# EAGLE design Mono main board V3 (EAGLE 7.4.0)

## Sheet 1 of 4
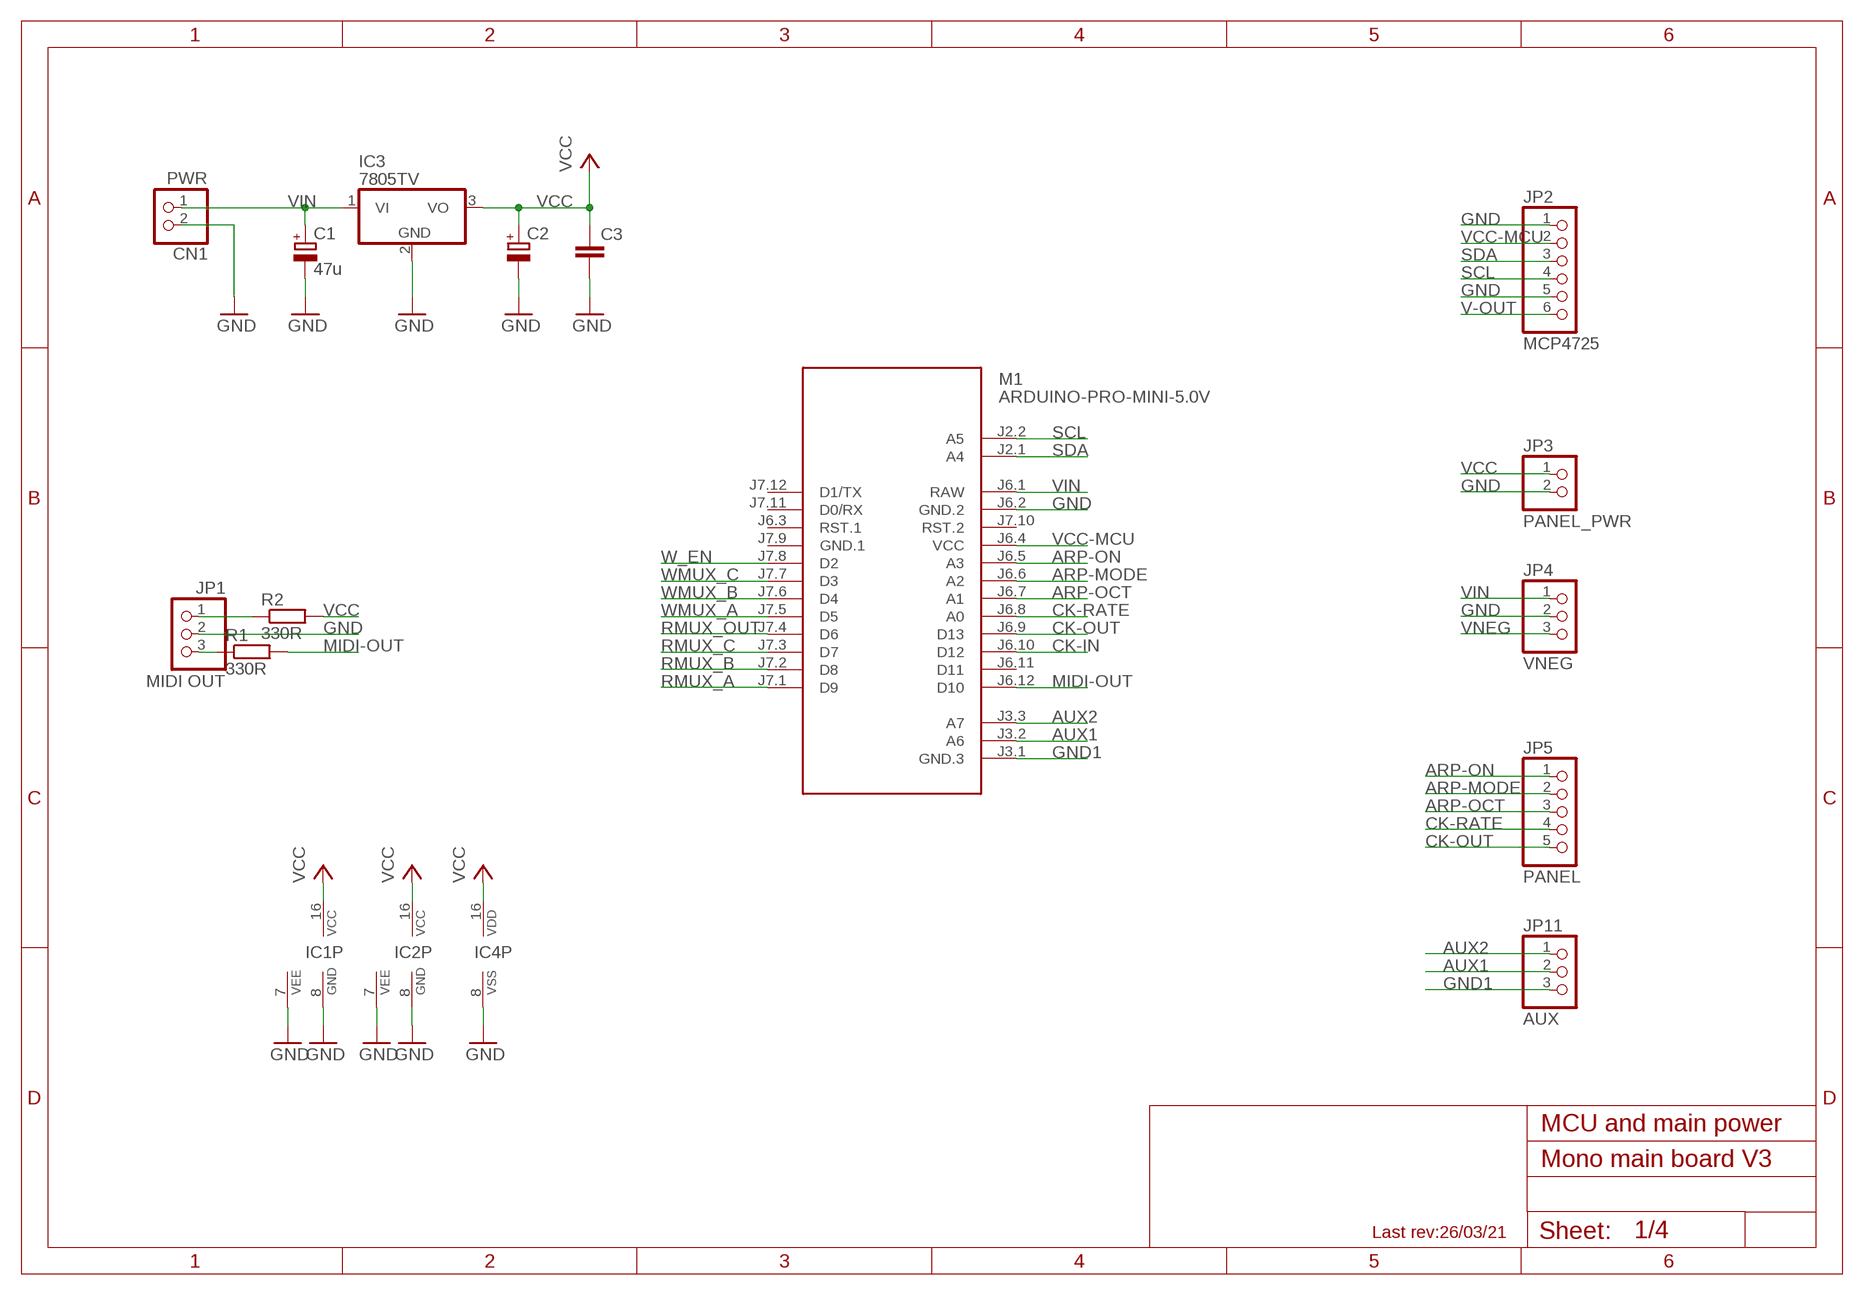
[diagram p0: schematic, sheet 1]

### Parts
C1  47u  CPOL-EUE5-8.5  [E5-8,5]
C2  CPOL-EUE5-8.5  [E5-8,5]
C3  C-EU050-025X075  [C050-025X075]
CN1  PWR  JST_2PIN-THM  [JST-PH-2-THM]
IC1  4051D  [SO16]
IC2  4051D  [SO16]
IC3  7805TV  [TO220V]
IC4  4040N  [DIL16]
JP1  MIDI OUT  PINHD-1X3  [1X03]
JP2  MCP4725  PINHD-1X6CB  [1X06-CLEANBIG]
JP3  PANEL_PWR  PINHD-1X2  [1X02]
JP4  VNEG  PINHD-1X3  [1X03]
JP5  PANEL  PINHD-1X5  [1X05]
JP11  AUX  PINHD-1X3  [1X03]
M1  ARDUINO-PRO-MINI-5.0V  ARDUINO-PRO-MINI-5.0V#NP  [ARDUINO-PRO-MINI#NP]
R1  330R  R-EU_R0805  [R0805]
R2  330R  R-EU_R0805  [R0805]

### Nets
ARP-MODE: JP5.2 M1.J6.6(A2)
ARP-OCT: JP5.3 M1.J6.7(A1)
ARP-ON: JP5.1 M1.J6.5(A3)
AUX1: JP11.2 M1.J3.2(A6)
AUX2: JP11.1 M1.J3.3(A7)
CK-IN: M1.J6.10(D12) ; also sheet 2
CK-OUT: JP5.5 M1.J6.9(D13)
CK-RATE: JP5.4 M1.J6.8(A0)
GND: C1.- C2.- C3.2 CN1.2 IC1.7(VEE) IC1.8(GND) IC2.7(VEE) IC2.8(GND) IC3.2(GND) IC4.8(VSS) JP1.2 JP2.1 JP2.5 JP3.2 JP4.2 M1.J6.2(GND.2) ; also sheet 2,3,4
GND1: JP11.3 M1.J3.1(GND.3)
MIDI-OUT: M1.J6.12(D10) R1.2
N$5: JP1.1 R2.1
N$6: JP1.3 R1.1
RMUX_A: M1.J7.1(D9) ; also sheet 2
RMUX_B: M1.J7.2(D8) ; also sheet 2
RMUX_C: M1.J7.3(D7) ; also sheet 2
RMUX_OUT: M1.J7.4(D6) ; also sheet 2
SCL: JP2.4 M1.J2.2(A5)
SDA: JP2.3 M1.J2.1(A4)
V-OUT: JP2.6 ; also sheet 3
VCC: C2.+ C3.1 IC1.16(VCC) IC2.16(VCC) IC3.3(VO) IC4.16(VDD) JP3.1 R2.2 ; also sheet 2,3
VCC-MCU: JP2.2 M1.J6.4(VCC)
VIN: C1.+ CN1.1 IC3.1(VI) JP4.1 M1.J6.1(RAW) ; also sheet 4
VNEG: JP4.3 ; also sheet 3,4
W_EN: M1.J7.8(D2) ; also sheet 2
WMUX_A: M1.J7.5(D5) ; also sheet 2
WMUX_B: M1.J7.6(D4) ; also sheet 2
WMUX_C: M1.J7.7(D3) ; also sheet 2
Unconnected: M1.J6.3(RST.1) M1.J6.11(D11) M1.J7.10(RST.2) M1.J7.11(D0/RX) M1.J7.12(D1/TX)

### Notes on the sheet
- MCU and main power
- Last rev:26/03/21

## Sheet 2 of 4
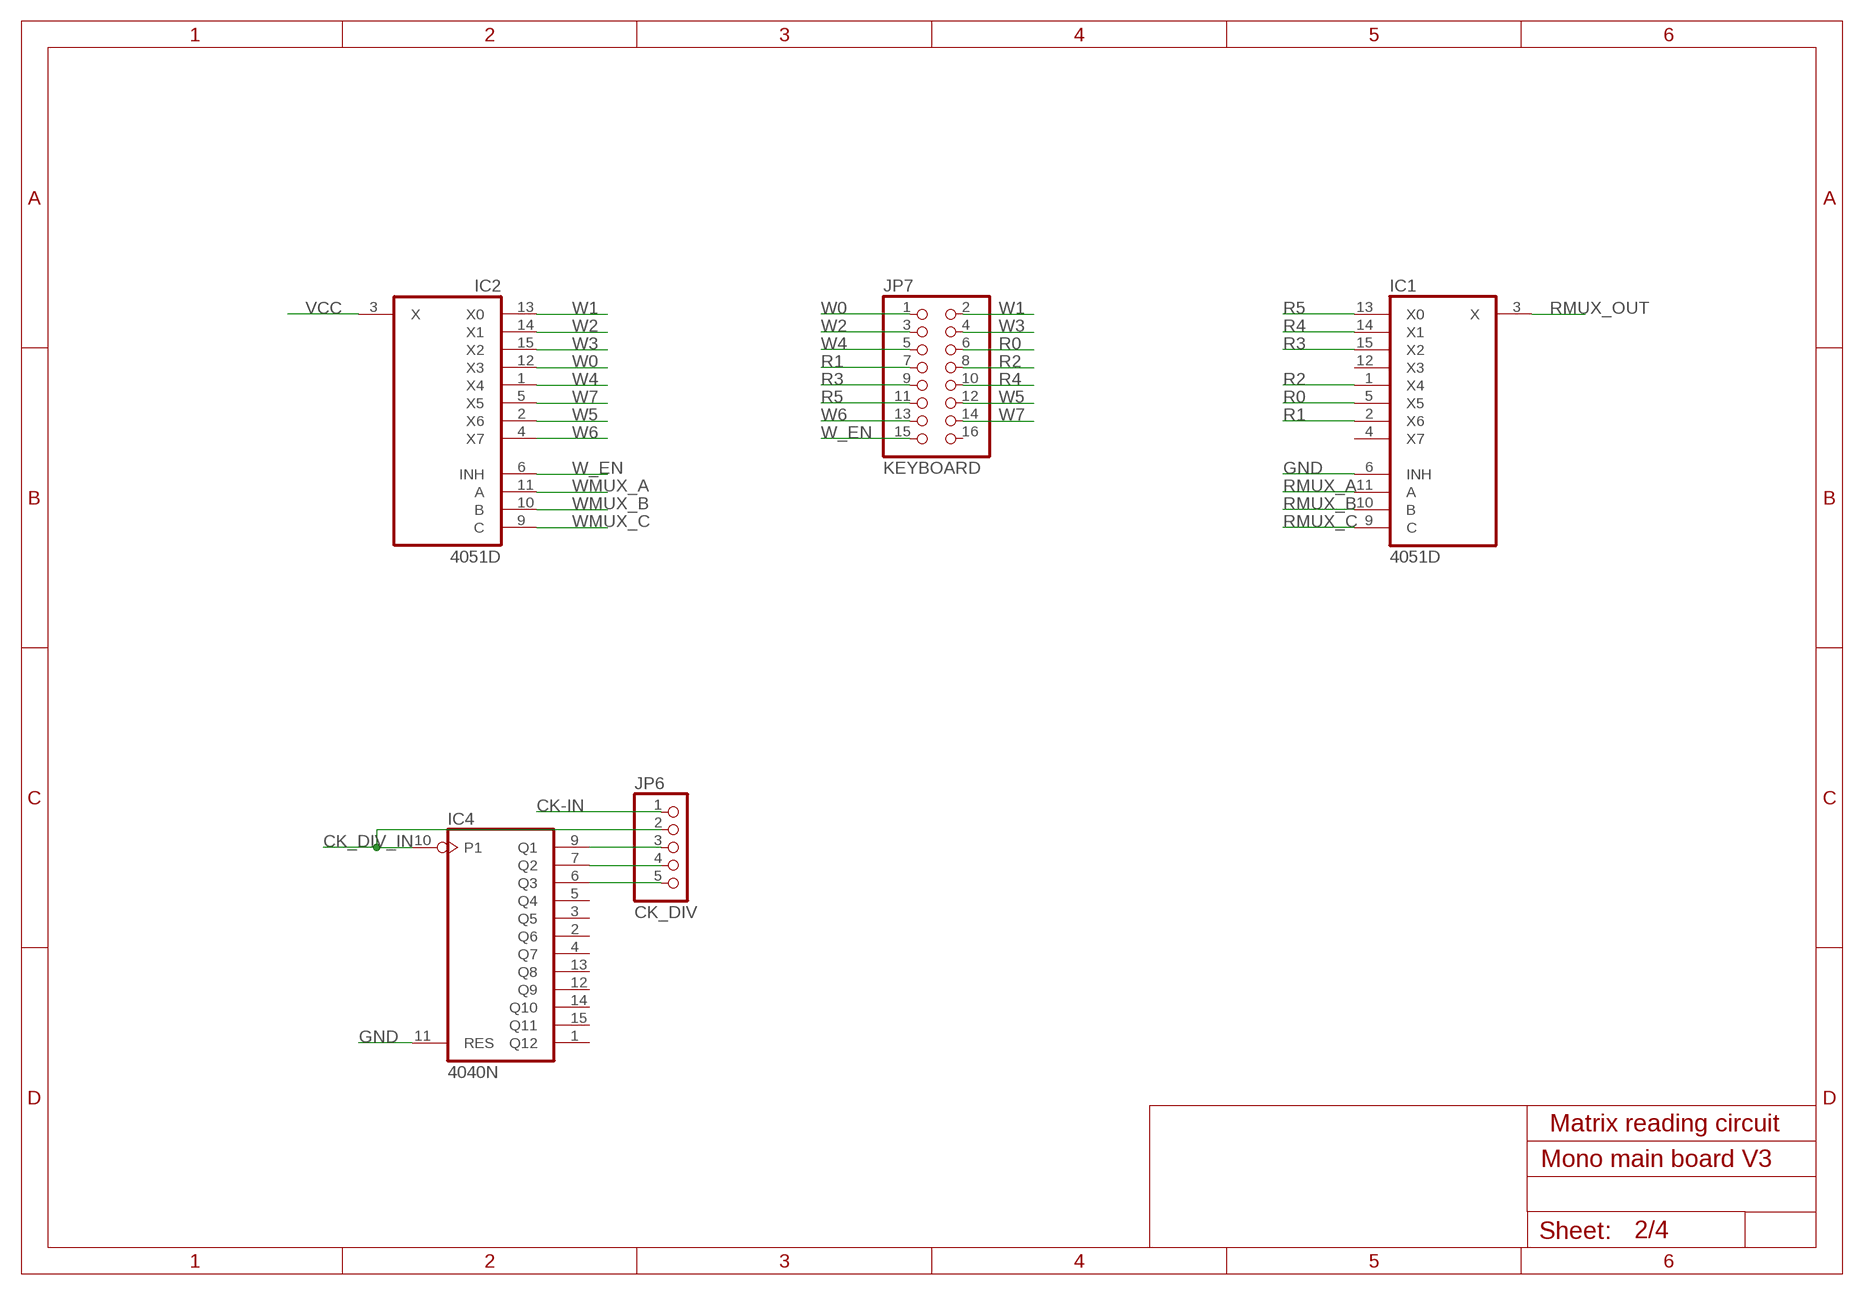
[diagram p1: schematic, sheet 2]

### Parts
JP6  CK_DIV  PINHD-1X5  [1X05]
JP7  KEYBOARD  PINHD-2X8  [2X08]

### Nets
CK-IN: JP6.1 ; also sheet 1
CK_DIV_IN: IC4.10(P1) JP6.2
GND: IC1.6(INH) IC4.11(RES) ; also sheet 1,3,4
N$1: IC4.9(Q1) JP6.3
N$2: IC4.7(Q2) JP6.4
N$3: IC4.6(Q3) JP6.5
R0: IC1.5(X5) JP7.6
R1: IC1.2(X6) JP7.7
R2: IC1.1(X4) JP7.8
R3: IC1.15(X2) JP7.9
R4: IC1.14(X1) JP7.10
R5: IC1.13(X0) JP7.11
RMUX_A: IC1.11(A) ; also sheet 1
RMUX_B: IC1.10(B) ; also sheet 1
RMUX_C: IC1.9(C) ; also sheet 1
RMUX_OUT: IC1.3(X) ; also sheet 1
VCC: IC2.3(X) ; also sheet 1,3
W0: IC2.12(X3) JP7.1
W1: IC2.13(X0) JP7.2
W2: IC2.14(X1) JP7.3
W3: IC2.15(X2) JP7.4
W4: IC2.1(X4) JP7.5
W5: IC2.2(X6) JP7.12
W6: IC2.4(X7) JP7.13
W7: IC2.5(X5) JP7.14
W_EN: IC2.6(INH) JP7.15 ; also sheet 1
WMUX_A: IC2.11(A) ; also sheet 1
WMUX_B: IC2.10(B) ; also sheet 1
WMUX_C: IC2.9(C) ; also sheet 1
Unconnected: IC1.4(X7) IC1.12(X3) IC4.1(Q12) IC4.2(Q6) IC4.3(Q5) IC4.4(Q7) IC4.5(Q4) IC4.12(Q9) IC4.13(Q8) IC4.14(Q10) IC4.15(Q11) JP7.16

### Notes on the sheet
- Matrix reading circuit

## Sheet 3 of 4
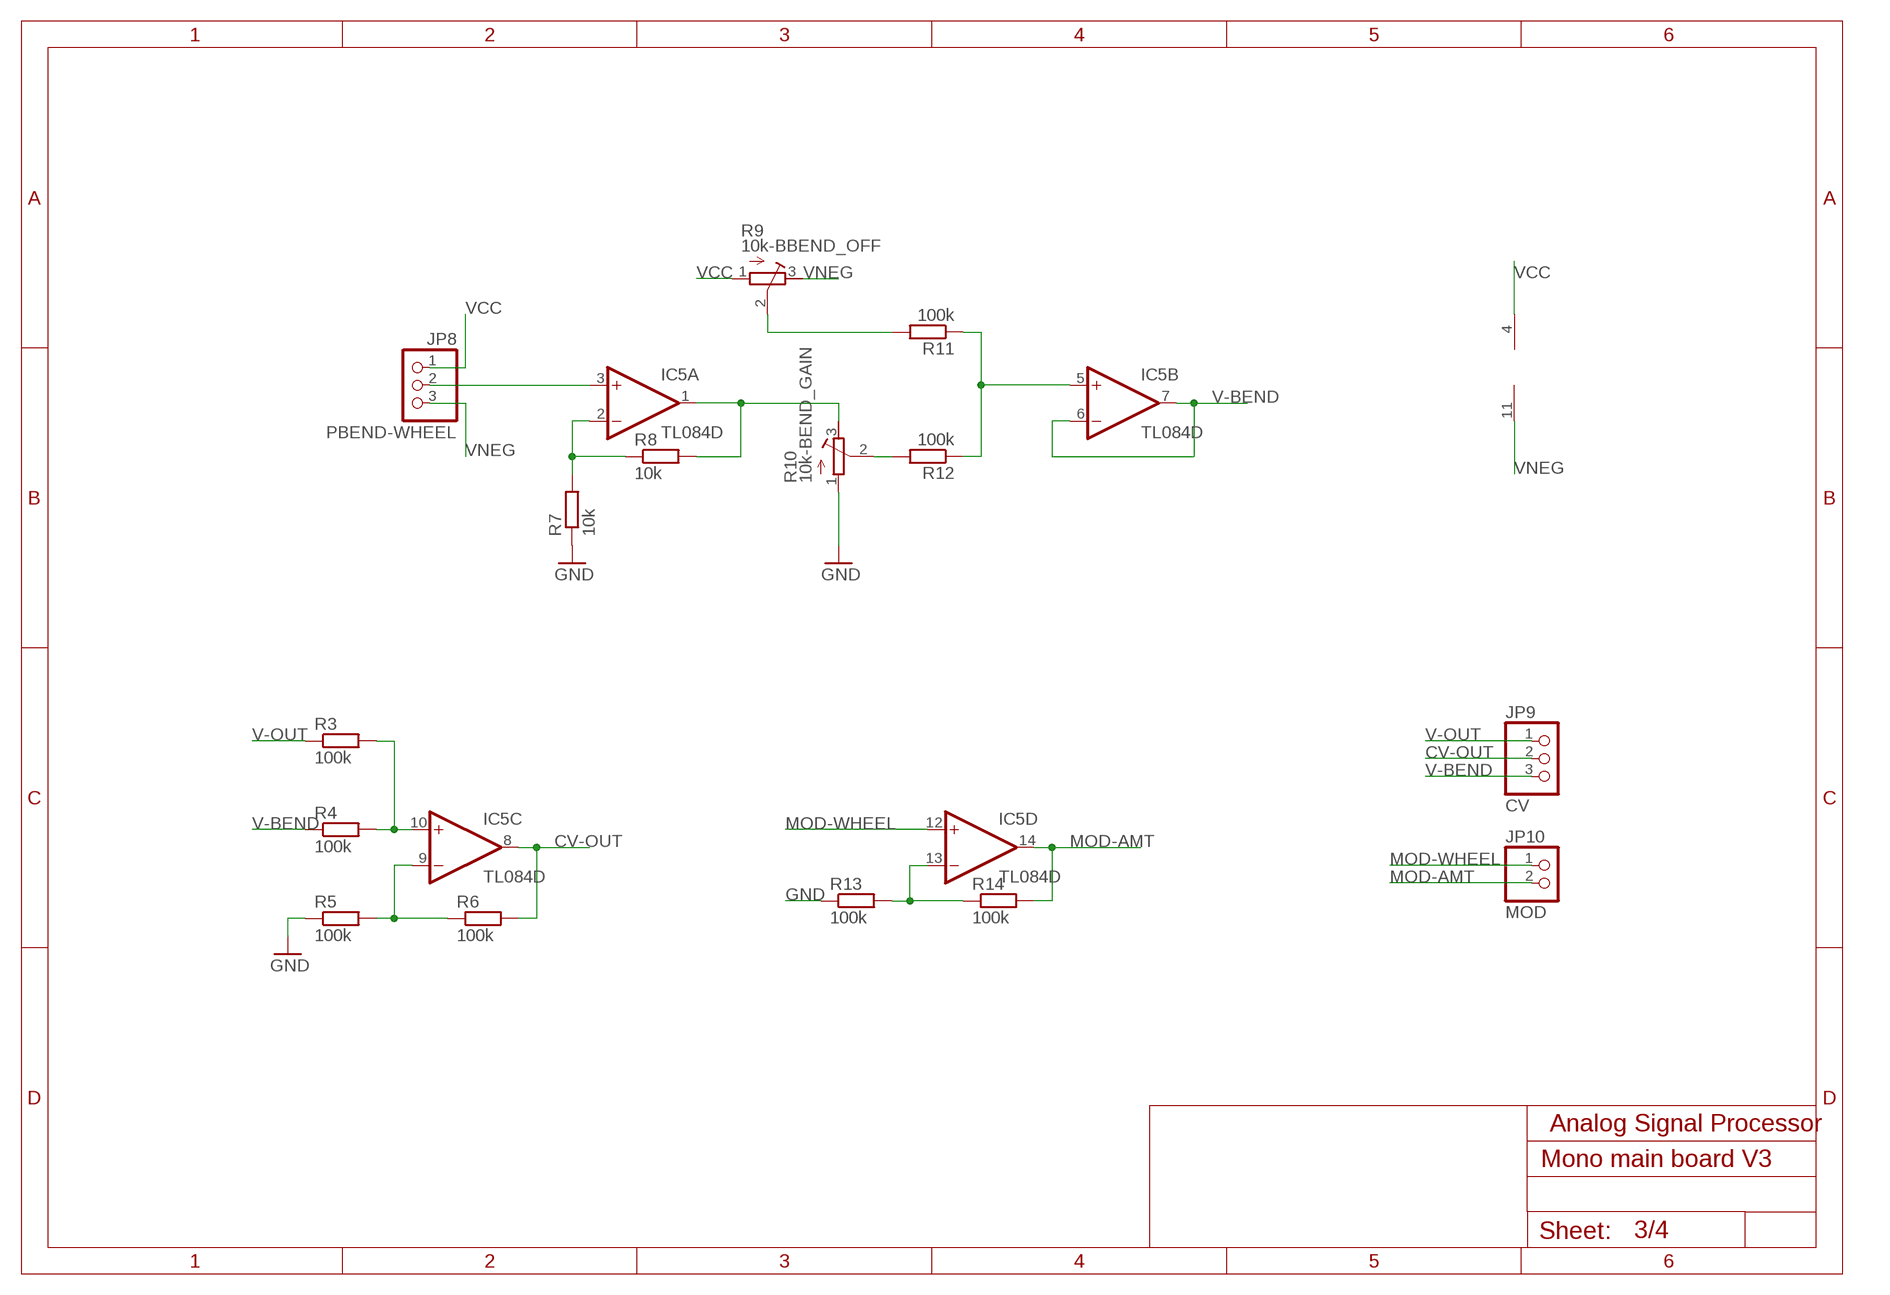
[diagram p2: schematic, sheet 3]

### Parts
IC5  TL084D  [SO14]
JP8  PBEND-WHEEL  PINHD-1X3  [1X03]
JP9  CV  PINHD-1X3  [1X03]
JP10  MOD  PINHD-1X2  [1X02]
R3  100k  R-EU_R0805  [R0805]
R4  100k  R-EU_R0805  [R0805]
R5  100k  R-EU_R0805  [R0805]
R6  100k  R-EU_R0805  [R0805]
R7  10k  R-EU_R0805  [R0805]
R8  10k  R-EU_R0805  [R0805]
R9  10k-BBEND_OFF  R-TRIMM64W  [RTRIM64W]
R10  10k-BEND_GAIN  R-TRIMM64W  [RTRIM64W]
R11  100k  R-EU_R0805  [R0805]
R12  100k  R-EU_R0805  [R0805]
R13  100k  R-EU_R0805  [R0805]
R14  100k  R-EU_R0805  [R0805]

### Nets
CV-OUT: IC5.8(C:OUT) JP9.2 R6.2
GND: R5.1 R7.1 R10.1(A) R13.1 ; also sheet 1,2,4
MOD-AMT: IC5.14(D:OUT) JP10.2 R14.2
MOD-WHEEL: IC5.12(D:+IN) JP10.1
N$4: IC5.10(C:+IN) R3.2 R4.2
N$7: IC5.9(C:-IN) R5.2 R6.1
N$8: IC5.3(A:+IN) JP8.2
N$9: IC5.2(A:-IN) R7.2 R8.1
N$10: R10.2(S) R12.2
N$11: R9.2(S) R11.2
N$12: IC5.5(B:+IN) R11.1 R12.1
N$13: IC5.13(D:-IN) R13.2 R14.1
N$14: IC5.1(A:OUT) R8.2 R10.3(E)
V-BEND: IC5.6(B:-IN) IC5.7(B:OUT) JP9.3 R4.1
V-OUT: JP9.1 R3.1 ; also sheet 1
VCC: IC5.4(P:V+) JP8.1 R9.1(A) ; also sheet 1,2
VNEG: IC5.11(P:V-) JP8.3 R9.3(E) ; also sheet 1,4

### Notes on the sheet
- Analog Signal Processor

## Sheet 4 of 4
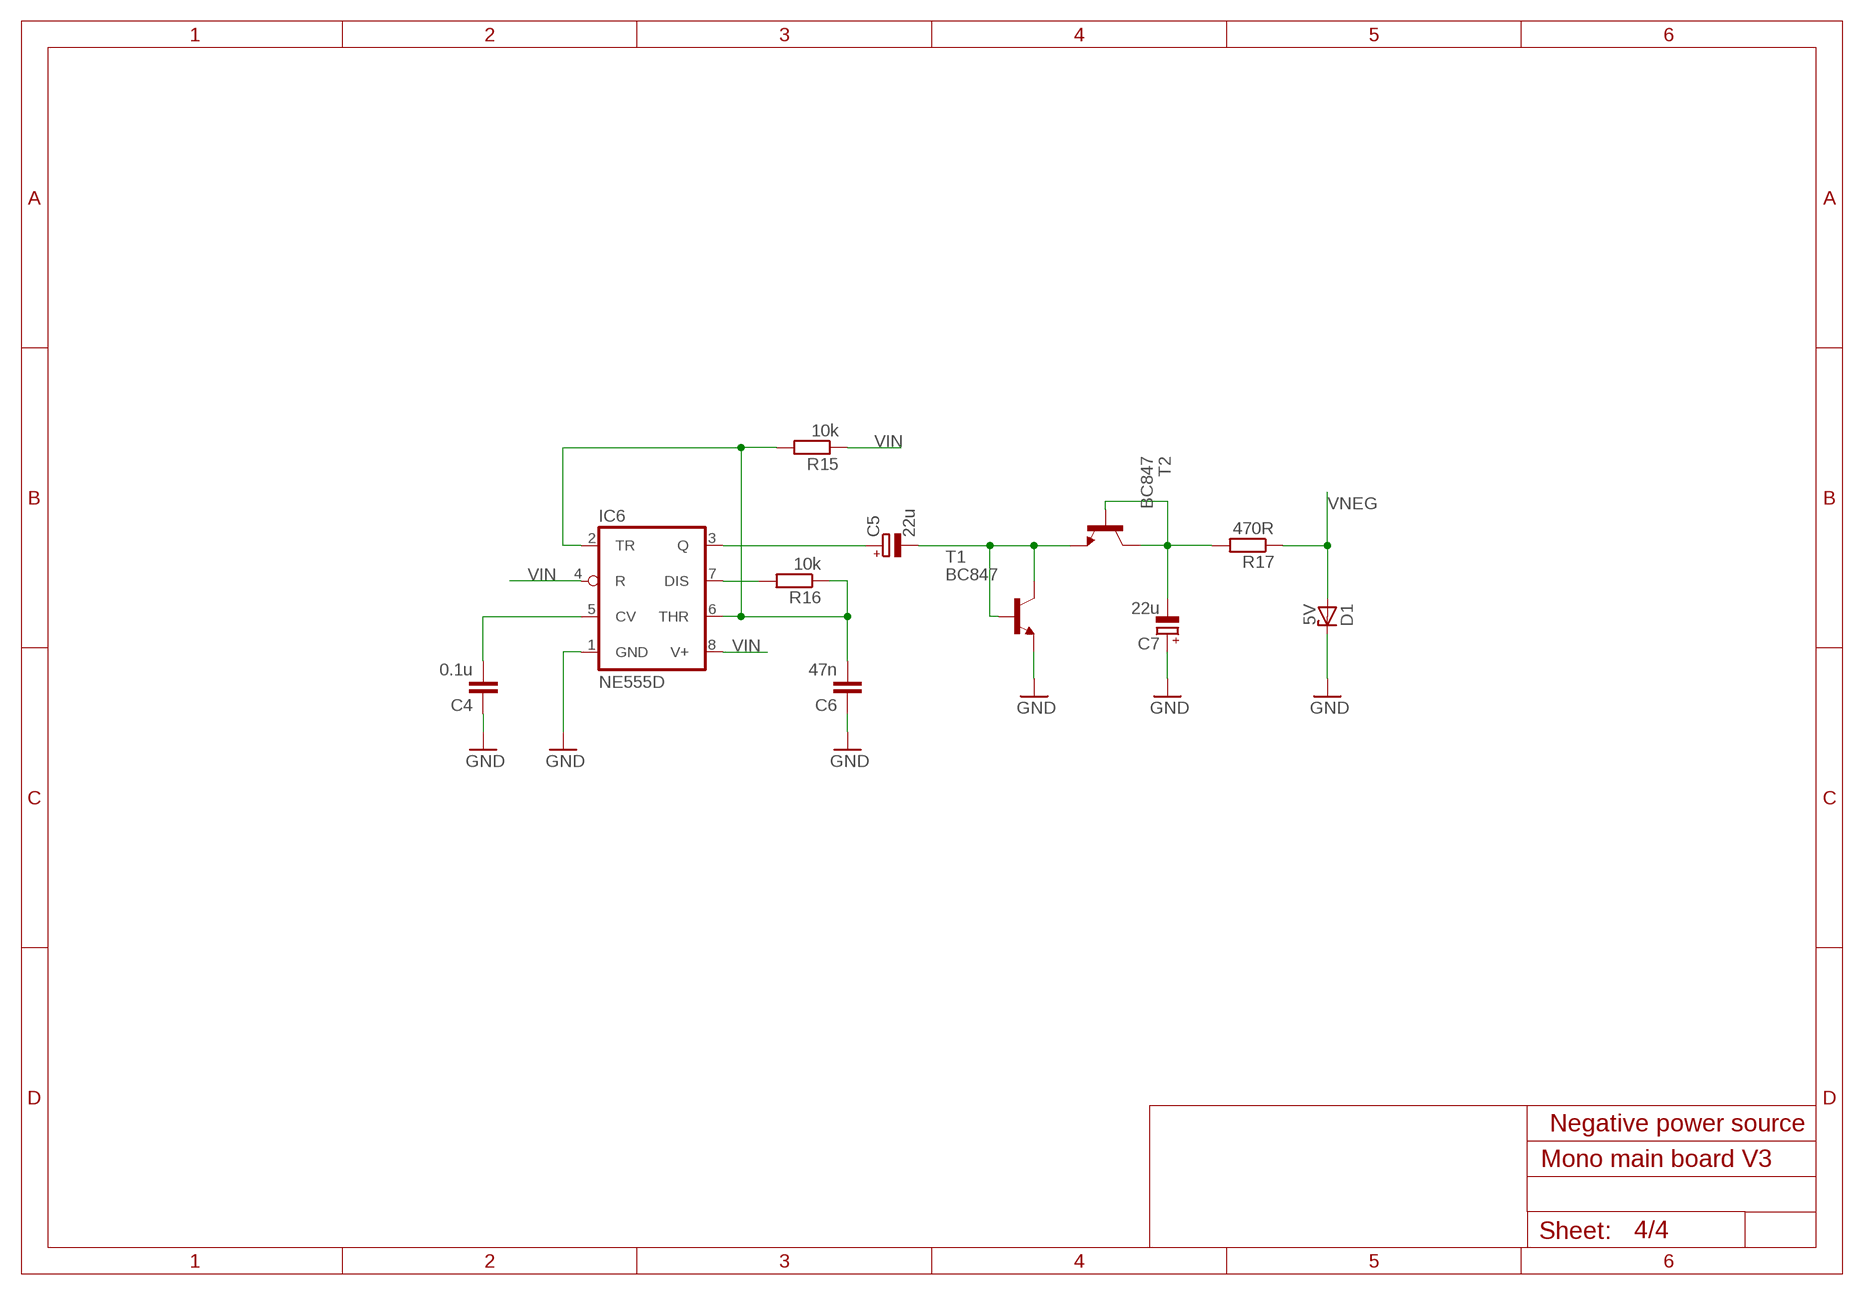
[diagram p3: schematic, sheet 4]

### Parts
C4  0.1u  C-EUC0805  [C0805]
C5  22u  CPOL-EUE5-10.5  [E5-10,5]
C6  47n  C-EUC0805  [C0805]
C7  22u  CPOL-EUE5-10.5  [E5-10,5]
D1  5V  ZENER-DIODEZD-2.5  [ZDIO-2.5]
IC6  NE555D  [SO08]
R15  10k  R-EU_M0805  [M0805]
R16  10k  R-EU_M0805  [M0805]
R17  470R  R-EU_M0805  [M0805]
T1  BC847  [SOT23]
T2  BC847  [SOT23]

### Nets
GND: C4.1 C6.1 C7.+ D1.C IC6.1(GND) T1.2(E) ; also sheet 1,2,3
N$15: C4.2 IC6.5(CV)
N$16: C6.2 IC6.2(TR) IC6.6(THR) R15.2 R16.1
N$17: IC6.7(DIS) R16.2
N$18: C5.+ IC6.3(Q)
N$21: C7.- R17.2 T2.1(B) T2.3(C)
N$22: C5.- T1.1(B) T1.3(C) T2.2(E)
VIN: IC6.4(R) IC6.8(V+) R15.1 ; also sheet 1
VNEG: D1.A R17.1 ; also sheet 1,3

### Notes on the sheet
- Negative power source

## Power pins joined to a net without a drawn wire
GND.1: M1.J7.9(GND.1)

## Library data of the parts
C1 C2 C5 C7 = rcl:CPOL-EU: POLARIZED CAPACITOR, European symbol
C3 C4 C6 = rcl:C-EU: CAPACITOR, European symbol
CN1 = adafruit:JST_2PIN: JST 2-Pin Connectors of various flavors SMT-RA (S2B-PH-SM4) 4UConnector #17311 SMT (B2B-PH-SM4) THM-RA (S2B-PH) THM (B2B-PH)
D1 = diode:ZENER-DIODE: Z-Diode
IC1 IC2 = 40xx:4051: 8-channel ANALOG MULTIPLEXER
IC3 = linear:78*: Positive VOLTAGE REGULATOR Source: http://cache.national.com/ds/LM/LM78L05.pdf http://www.fairchildsemi.com/ds/LM/LM7805.pdf
IC4 = 40xx:4040: 12-stage binary/ripple COUNTER
IC5 = linear:TL084: OP AMP
IC6 = adafruit:*555: TIMER Changed DIP package to have round (not oval) pin pads http://www.ladyada.net/library/pcb/eaglelibrary.html
JP1 JP4 JP8 JP9 JP11 = pinhead:PINHD-1X3: PIN HEADER
JP2 = adafruit:PINHD-1X6: PIN HEADER
JP3 JP10 = pinhead:PINHD-1X2: PIN HEADER
JP5 JP6 = pinhead:PINHD-1X5: PIN HEADER
JP7 = pinhead:PINHD-2X8: PIN HEADER
M1 = diy-modules:ARDUINO-PRO-MINI-*#NP: Arduino Pro Mini (and compatible devices) without programming pads More details available here: https://www.arduino.cc/en/Main/ArduinoBoardProMini Click here to find device on ebay.com <http://www.ebay.com/sch/arduino+pro+mini>
R1-R8 R11-R17 = rcl:R-EU_: RESISTOR, European symbol
R9 R10 = rcl:R-TRIMM: Trimm resistor
T1 T2 = transistor:BC847: NPN TRANSISTOR

## Board
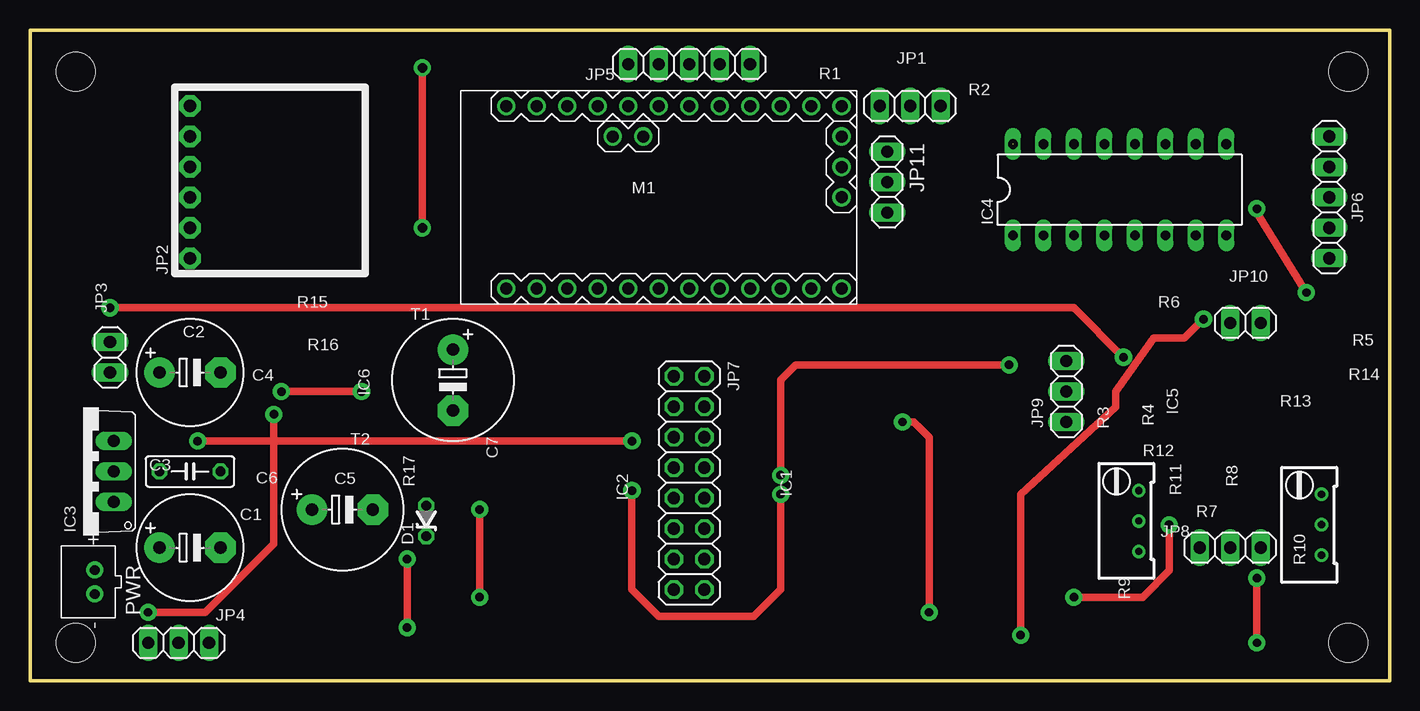
[diagram p4: board, top side]
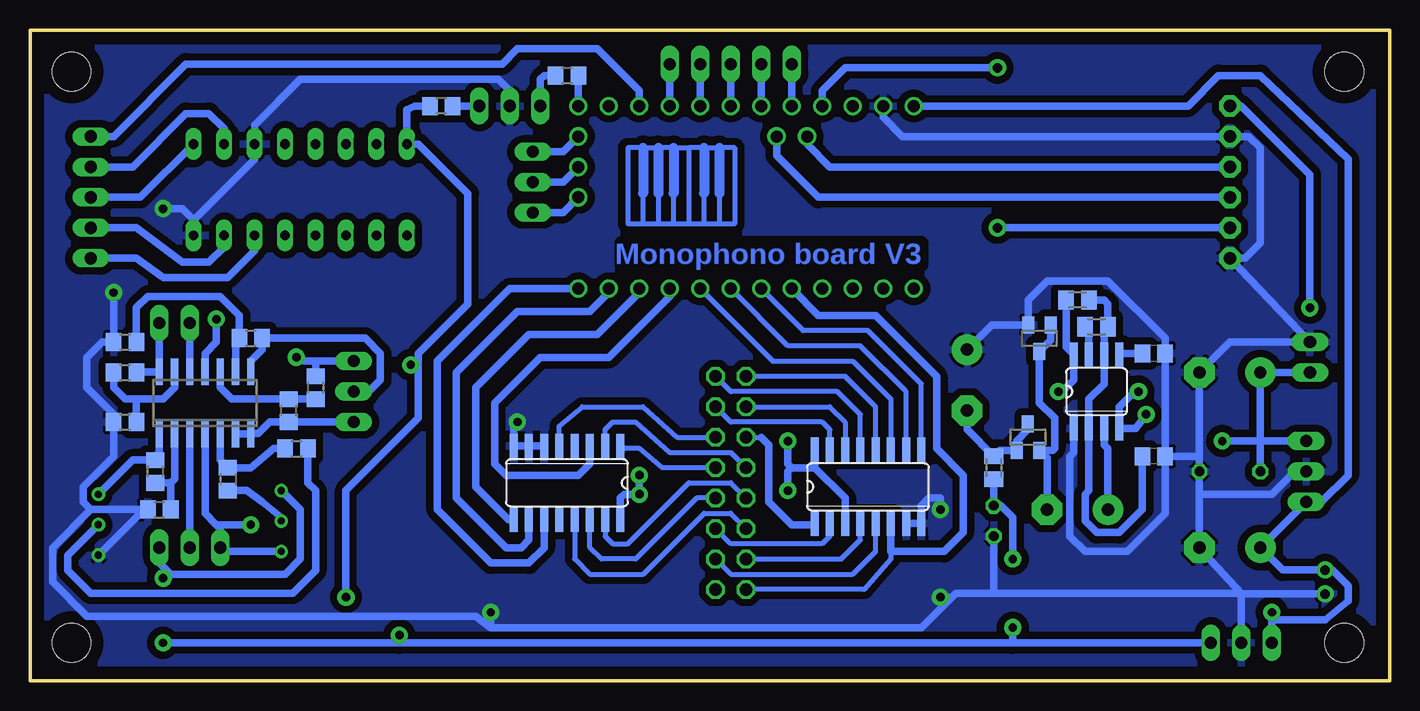
[diagram p5: board, bottom side, seen from below]

Size 113.33 x 54.28 mm. Coordinates in mm from the lower left corner, seen from the top.
Outline: 0,0 113.33,0 113.33,54.28 0,54.28 0,0
Copper layers (1*16): Top 0.035mm / dielectric 1.5mm / Bottom 0.035mm
Design rules "default": minimum track width 10mil, minimum drill 24mil, track to track 8mil, track to pad 8mil, pad to pad 8mil, via to via 8mil, smd to smd 8mil, copper to edge 40mil, drill to drill 8mil, minimum pad ring 10mil, minimum via ring 8mil, stop-mask expansion 4mil, vias tented up to drill 0mil, thermal gap 10mil
Holes 3.2 mm at 3.81,50.8 109.86,50.8 109.86,3.17 3.81,3.17

### Footprints (pad centres in the part's own frame; a part is rotated, then mirrored left to right if it is on the bottom)
E5-8,5 = drill 1.016 pad 2.54: + -2.54,0 | drill 1.016 pad 2.54 octagon: - 2.54,0
C050-025X075 = drill 0.813 octagon: 1 -2.54,0; 2 2.54,0
C0805 = smd 1.3 x 1.5: 1 -0.95,0; 2 0.95,0
E5-10,5 = drill 1.016 pad 2.54: + -2.54,0 | drill 1.016 pad 2.54 octagon: - 2.54,0
JST-PH-2-THM = drill 0.8 pad 1.422: 1 1,0; 2 -1,0
ZDIO-2.5 = drill 0.813 octagon: A 1.27,0; C -1.27,0
SO16 = smd 0.66 x 2.032: 1 -4.445,-3.073; 2 -3.175,-3.073; 3 -1.905,-3.073; 4 -0.635,-3.073; 5 0.635,-3.073; 6 1.905,-3.073; 7 3.175,-3.073; 8 4.445,-3.073; 9 4.445,3.073; 10 3.175,3.073; 11 1.905,3.073; 12 0.635,3.073; 13 -0.635,3.073; 14 -1.905,3.073; 15 -3.175,3.073; 16 -4.445,3.073
TO220V = drill 1.016 long: 1 -2.54,-2.54; 2 0,-2.54; 3 2.54,-2.54
DIL16 = drill 0.813 long: 1 -8.89,-3.81; 2 -6.35,-3.81; 3 -3.81,-3.81; 4 -1.27,-3.81; 5 1.27,-3.81; 6 3.81,-3.81; 7 6.35,-3.81; 8 8.89,-3.81; 9 8.89,3.81; 10 6.35,3.81; 11 3.81,3.81; 12 1.27,3.81; 13 -1.27,3.81; 14 -3.81,3.81; 15 -6.35,3.81; 16 -8.89,3.81
SO14 = smd 0.6 x 2.2: 1 -3.81,-2.6; 2 -2.54,-2.6; 3 -1.27,-2.6; 4 0,-2.6; 5 1.27,-2.6; 6 2.54,-2.6; 7 3.81,-2.6; 8 3.81,2.6; 9 2.54,2.6; 10 1.27,2.6; 11 0,2.6; 12 -1.27,2.6; 13 -2.54,2.6; 14 -3.81,2.6
SO08 = smd 0.66 x 2.032: 1 -1.905,-3.073; 2 -0.635,-3.073; 3 0.635,-3.073; 4 1.905,-3.073; 5 1.905,3.073; 6 0.635,3.073; 7 -0.635,3.073; 8 -1.905,3.073
1X03 = drill 1.016 long: 1 -2.54,0; 2 0,0; 3 2.54,0
1X06-CLEANBIG = drill 1.016 pad 1.778 octagon: 1 -6.35,0; 2 -3.81,0; 3 -1.27,0; 4 1.27,0; 5 3.81,0; 6 6.35,0
1X02 = drill 1.016 long: 1 -1.27,0; 2 1.27,0
1X05 = drill 1.016 long: 1 -5.08,0; 2 -2.54,0; 3 0,0; 4 2.54,0; 5 5.08,0
2X08 = drill 1.016 octagon: 1 -8.89,-1.27; 2 -8.89,1.27; 3 -6.35,-1.27; 4 -6.35,1.27; 5 -3.81,-1.27; 6 -3.81,1.27; 7 -1.27,-1.27; 8 -1.27,1.27; 9 1.27,-1.27; 10 1.27,1.27; 11 3.81,-1.27; 12 3.81,1.27; 13 6.35,-1.27; 14 6.35,1.27; 15 8.89,-1.27; 16 8.89,1.27
ARDUINO-PRO-MINI#NP = drill 1: J2.1 -1.27,5.08; J2.2 -3.81,5.08; J3.1 15.24,0; J3.2 15.24,2.54; J3.3 15.24,5.08; J6.1 -12.7,7.62; J6.2 -10.16,7.62; J6.3 -7.62,7.62; J6.4 -5.08,7.62; J6.5 -2.54,7.62; J6.6 0,7.62; J6.7 2.54,7.62; J6.8 5.08,7.62; J6.9 7.62,7.62; J6.10 10.16,7.62; J6.11 12.7,7.62; J6.12 15.24,7.62; J7.1 15.24,-7.62; J7.2 12.7,-7.62; J7.3 10.16,-7.62; J7.4 7.62,-7.62; J7.5 5.08,-7.62; J7.6 2.54,-7.62; J7.7 0,-7.62; J7.8 -2.54,-7.62; J7.9 -5.08,-7.62; J7.10 -7.62,-7.62; J7.11 -10.16,-7.62; J7.12 -12.7,-7.62
R0805 = smd 1.3 x 1.5: 1 -0.95,0; 2 0.95,0
RTRIM64W = drill 0.61: 1 1.27,-2.54; 2 1.27,0; 3 1.27,2.54
M0805 = smd 1.3 x 1.6: 1 -0.95,0; 2 0.95,0
SOT23 = smd 1 x 1.4: 1 -0.95,-1.1; 2 0.95,-1.1; 3 0,1.1

### Placement (x,y rotation side)
C1  13.34,11.11 0 top
C2  13.34,25.72 0 top
C3  13.34,17.46 0 top
C4  19.68,27.3 180 bottom
C5  26.04,14.29 0 top
C6  19.68,18.73 180 bottom
C7  35.24,25.08 270 top
CN1  5.4,8.26 90 top
D1  33.02,13.34 90 top
IC1  68.58,16.51 180 bottom
IC2  43.5,16.19 0 bottom
IC3  4.45,17.46 90 top
IC4  90.81,40.96 0 top
IC5  98.74,23.18 0 bottom
IC6  24.45,24.13 0 bottom
JP1  73.34,47.94 180 top
JP2  13.34,41.59 90 top
JP3  6.67,26.99 90 top
JP4  12.38,3.17 0 top
JP5  54.93,51.44 0 top
JP6  108.27,40.32 270 top
JP7  54.93,16.51 270 top
JP8  100.01,11.11 0 top
JP9  86.36,24.13 270 top
JP10  101.28,29.84 0 top
JP11  71.44,41.59 270 top
M1  52.39,40.32 0 top
R1  68.58,50.48 0 bottom
R2  79.06,47.94 180 bottom
R3  89.53,24.45 270 bottom
R4  91.76,22.54 90 bottom
R5  105.41,28.26 0 bottom
R6  94.93,28.57 0 bottom
R7  102.55,14.29 0 bottom
R8  102.87,17.46 90 bottom
R9  91.12,13.34 0 top
R10  106.36,13.02 0 top
R11  96.84,16.83 270 bottom
R12  91.12,19.37 0 bottom
R13  105.41,21.59 0 bottom
R14  105.41,25.72 0 bottom
R15  26.04,31.75 0 bottom
R16  24.45,29.53 180 bottom
R17  33.02,17.78 90 bottom
T1  29.21,28.57 180 bottom
T2  30.16,20.32 0 bottom

### Tracks (layer width: path | path; a pad name or v marks a point on that pad's centre or on a via)
ARP-MODE
  Bottom 0.61: M1.J6.6 JP5.2
ARP-OCT
  Bottom 0.61: M1.J6.7 JP5.3
ARP-ON
  Bottom 0.61: M1.J6.5 JP5.1
AUX1
  Bottom 0.61: JP11.2 68.9,41.59 M1.J3.2
AUX2
  Bottom 0.61: JP11.1 68.9,44.13 M1.J3.3
CK-IN
  Bottom 0.61: JP6.1 106.36,45.4 100.33,51.44 73.98,51.44 72.71,52.7 66.04,52.7 62.55,49.21 M1.J6.10
CK-OUT
  Bottom 0.61: M1.J6.9 JP5.5
CK-RATE
  Bottom 0.61: M1.J6.8 JP5.4
CK_DIV_IN
  Bottom 0.61: JP6.2 104.78,42.86 100.33,47.31 98.42,47.31 97.16,46.04 IC4.10
CV-OUT
  Bottom 0.61: IC5.8 94.93,26.67 93.98,27.62 R6.2 85.41,28.57 84.14,27.3 84.14,25.08 85.09,24.13 JP9.2
GND  (via drill 0.7 pad 1.42)
  Top 0.61: v37.47,14.29 v37.47,6.99 | v72.71,21.59 73.66,21.59 74.93,20.32 v74.93,5.71 | v106.36,32.38 102.23,39.05 v102.23,39.37
  Bottom 0.61: M1.J6.2 42.23,46.99 40.64,45.4 JP2.5 11.75,45.4 10.79,44.45 10.79,36.51 12.06,35.24 JP2.1 JP3.2 13.34,28.26 C2.- 15.88,18.73 | 15.88,15.56 C1.- 12.38,7.3 | 15.88,15.56 C3.2 15.88,18.73 | IC3.2 7.94,17.46 9.84,15.56 15.88,15.56 | CN1.2 12.02,7.25 12.38,7.3 | IC2.7 IC2.8 39.05,14.61 38.42,15.24 37.47,15.24 v37.47,14.29 | IC1.6 IC1.7 IC1.8 73.03,21.27 v72.71,21.59 | 99.69,38.42 94.61,43.5 IC4.11 94.61,46.35 90.81,50.16 74.3,50.16 73.34,49.21 JP1.2 | 99.69,38.42 IC4.8 | JP4.2 12.38,7.3 | R10.1 103.82,14.29 | 103.82,14.29 108.27,14.29 | 108.27,14.29 108.9,14.92 108.9,16.19 106.36,18.73 R13.1 106.36,22.22 108.58,24.45 108.58,26.99 107.31,28.26 R5.1 106.36,31.11 v106.36,32.38 | 74.93,4.45 v74.93,5.71 74.93,5.4 | 74.93,4.45 39.05,4.45 36.51,6.99 | 36.51,6.99 36.2,7.3 33.02,7.3 | 33.02,7.3 12.38,7.3 | R7.1 103.82,14.29 | 108.27,14.29 111.44,11.11 111.44,8.26 108.58,5.4 76.2,5.4 74.93,4.45 | v102.23,39.37 100.65,39.37 99.69,38.42 | v37.47,6.99 36.51,6.99 | C6.1 C4.1 18.73,28.57 23.5,33.34 28.57,33.34 30.16,31.75 T1.2 33.19,29.68 C7.+ | C6.1 15.88,18.73 | C6.1 18.73,13.97 21.91,10.79 25.4,10.79 26.67,12.06 26.67,18.73 26.35,19.05 IC6.1 | D1.C 33.02,7.3
  pour Bottom (isolate 0.61): 0,54.29 113.35,54.29 113.35,0 0,0
GND1
  Bottom 0.61: JP11.3 68.9,39.05 M1.J3.1
MIDI-OUT
  Bottom 0.61: M1.J6.12 R1.2
MOD-AMT
  Bottom 0.61: R14.2 104.4,25.78 IC5.14 JP10.2
MOD-WHEEL
  Bottom 0.61: JP10.1 IC5.12
N$1
  Bottom 0.61: JP6.3 104.14,40.32 IC4.9
N$2
  Bottom 0.61: JP6.4 104.46,37.78 100.65,34.92 98.42,34.92 97.16,36.2 IC4.7
N$3
  Bottom 0.61: JP6.5 104.46,35.24 102.23,33.66 96.84,33.66 94.61,35.88 IC4.6
N$4
  Bottom 0.61: IC5.10 97.47,24.45 96.52,23.49 R4.2 R3.2
N$5
  Bottom 0.61: R2.1 JP1.1
N$6
  Bottom 0.61: R1.1 70.48,50.48 70.8,50.16 JP1.3
N$7
  Bottom 0.61: IC5.9 96.2,28.25 R6.1 95.88,30.48 97.47,32.07 103.5,32.07 104.46,31.11 R5.2
N$8
  Bottom 0.61: IC5.3 JP8.2
N$9
  Bottom 0.61: R8.1 102.23,16.51 101.6,16.51 | IC5.2 101.28,16.83 101.6,16.51 | 101.6,16.51 R7.2
N$10
  Bottom 0.61: R12.2 90.17,16.51 89.53,15.88 89.53,9.21 91.44,7.3 108.27,7.3 110.17,9.21 110.17,10.48 R10.2
N$11
  Bottom 0.61: R9.2 92.39,13.65 93.98,14.92 95.25,15.88 R11.2
N$12
  Bottom 0.61: IC5.5 97.47,18.41 R11.1 96.52,17.78 94.93,17.78 93.03,19.37 R12.1
N$13
  Bottom 0.61: IC5.13 101.28,24.45 102.23,23.5 104.46,23.5 | 104.46,23.5 105.41,23.5 106.36,24.45 R14.1 | R13.2 104.46,23.49 104.46,23.5
N$14
  Bottom 0.61: IC5.1 102.55,19.05 102.87,18.73 R8.2 104.78,18.41 R10.3
N$15
  Bottom 0.61: C4.2 22.44,27.3 IC6.5
N$16
  Bottom 0.61: R15.2 23.81,31.75 23.5,31.43 R16.1 23.5,29.84 23.81,29.53 IC6.6 23.81,24.77 25.08,23.5 IC6.2 25.08,15.88 25.4,15.56 25.4,13.34 24.45,12.38 22.54,12.38 20.64,14.29 C6.2
N$17
  Bottom 0.61: IC6.7 25.08,29.84 R16.2
N$18
  Bottom 0.61: C5.+ 23.5,19.37 23.81,19.68 IC6.3
N$19
  Bottom 0.406: 55.88,38.1 54.61,38.1 54.61,44.45 55.88,44.45 57.15,44.45 58.42,44.45 | 57.15,38.1 58.42,38.1 | 59.69,38.1 60.96,38.1 | 62.23,38.1 63.5,38.1 63.5,44.45 62.23,44.45 60.96,44.45 59.69,44.45 58.42,44.45 | 55.88,40.64 55.88,38.1 | 55.88,38.1 57.15,38.1 | 57.15,38.1 57.15,40.64 | 58.42,44.45 58.42,38.1 | 58.42,38.1 59.69,38.1 | 59.69,38.1 59.69,40.64 | 60.96,40.64 60.96,38.1 | 60.96,38.1 62.23,38.1 | 62.23,38.1 62.23,40.64
  Bottom 0.813: 55.88,44.45 55.88,40.64 | 57.15,44.45 57.15,40.64 | 59.69,44.45 59.69,40.64 | 60.96,44.45 60.96,40.64 | 62.23,44.45 62.23,40.64
N$21
  Bottom 0.61: T2.3 30.16,20.95 31.11,20 T2.1 32.53,19.22 R17.2 35.24,20.95 C7.-
N$22
  Bottom 0.61: C5.- 28.57,18.58 T2.2 28.09,19.22 27.94,19.37 27.94,21.91 29.21,23.18 T1.3 28.26,28.43 T1.1
R0
  Bottom 0.406: IC1.5 69.22,21.27 67.31,22.86 62.23,22.86 59.37,20.32 JP7.6
R1
  Bottom 0.406: IC1.2 65.41,20.95 64.77,21.59 62.87,21.59 60.01,19.05 54.93,19.05 JP7.7
R2
  Bottom 0.406: JP7.8 60.64,17.78 62.55,19.37 63.92,19.37
  Bottom 0.61: 63.92,19.37 IC1.1
R3
  Bottom 0.406: IC1.15 65.41,12.06 64.77,11.43 63.5,11.43 58.42,16.51 54.93,16.51 JP7.9
R4
  Bottom 0.406: JP7.10 57.78,15.24 62.87,10.16 65.72,10.16 66.67,11.11 IC1.14
R5
  Bottom 0.406: IC1.13 67.94,10.16 66.67,8.89 62.23,8.89 57.15,13.97 54.93,13.97 JP7.11
RMUX_A
  Bottom 0.61: IC1.11 70.48,11.11 71.75,9.84 74.93,9.84 79.38,14.29 79.38,26.67 73.34,32.7 M1.J7.1
RMUX_B
  Bottom 0.61: M1.J7.2 65.09,32.38 66.67,30.8 72.71,30.8 77.79,25.72 77.79,15.24 73.66,11.11 72.39,11.11 71.75,11.75 IC1.10
RMUX_C
  Bottom 0.61: IC1.9 73.44,13.44 76.2,16.19 76.2,24.45 71.75,28.89 66.04,28.89 62.55,32.38 M1.J7.3
RMUX_OUT
  Bottom 0.61: IC1.3 66.67,18.1 67.63,17.14 73.66,17.14 74.61,18.1 74.61,23.18 70.8,26.99 65.09,26.99 60.01,32.07 M1.J7.4
SCL
  Bottom 0.61: JP2.4 46.67,42.86 48.58,44.77 M1.J2.2
SDA
  Bottom 0.61: JP2.3 47.62,40.32 51.12,43.81 M1.J2.1
V-BEND
  Bottom 0.61: IC5.6 IC5.7 94.87,20.64 94.3,20.64 93.34,21.59 92.39,21.59 | R4.1 92.39,21.59 | JP9.3 92.39,21.59
V-OUT  (via drill 0.7 pad 1.42)
  Top 0.61: v6.67,31.11 87,31.11 v91.12,26.99
  Bottom 0.61: JP2.6 12.38,47.94 6.67,42.23 v6.67,31.11 | v91.12,26.98 v91.12,26.99 90.49,26.67 89.53,26.67 | 89.53,26.67 R3.1 | JP9.1 89.53,26.67
VCC  (via drill 0.7 pad 1.42)  (1 unrouted)
  Top 0.61: v13.97,20 v50.16,20 | v62.55,15.56 62.55,7.62 60.33,5.4 52.39,5.4 50.16,7.62 v50.16,15.88 | v94.93,13.02 94.93,9.21 92.71,6.99 v87,6.99 | v81.6,26.35 63.82,26.35 62.55,25.08 v62.55,17.14
  Bottom 0.61: 10.79,20 C3.1 | IC3.3 10.79,20 | 10.79,20 C2.+ JP3.1 | IC2.16 47.94,17.78 | 47.94,17.78 45.4,15.24 IC2.3 | IC4.16 80.96,44.77 76.83,40.64 76.83,31.43 80.96,27.3 80.96,26.35 | 10.79,20 v13.97,20 | v50.16,20 50.16,18.1 49.85,17.78 | 49.85,17.78 47.94,17.78 | IC1.16 64.14,15.24 63.82,15.56 v62.55,15.56 v62.55,17.14 | v50.16,15.88 50.16,17.46 49.85,17.78 | 97.79,13.02 97.47,12.7 JP8.1 97.16,10.79 R9.1 | IC5.4 98.74,13.97 97.79,13.02 | 97.79,13.02 v94.93,13.02 | v87,6.99 87,15.88 80.96,21.91 80.96,26.35 | 80.96,26.35 v81.6,26.35 | R2.2 81.28,47.94 81.92,47.62 IC4.16
VCC-MCU  (via drill 0.8 pad 1.42)
  Top 0.61: v32.7,37.78 v32.7,51.12
  Bottom 0.61: M1.J6.4 47.31,49.21 45.4,51.12 v32.7,51.12 | JP2.2 v32.7,37.78
VIN  (via drill 0.7 pad 1.42)
  Top 0.61: v27.62,24.13 v20.95,24.13 | v20.32,22.23 20.32,11.43 14.61,5.71 v9.84,5.71
  Bottom 0.61: M1.J6.1 16.83,47.94 14.29,50.48 10.79,50.48 3.49,43.5 3.49,17.14 5.71,14.92 IC3.1 C1.+ 8.94,9.26 CN1.1 4.81,9.26 3.49,7.94 3.49,6.67 5.4,5.08 9.84,5.08 | v27.62,24.13 27.3,24.13 26.35,25.08 IC6.8 26.98,27.84 R15.1 | v20.95,24.13 21.27,24.13 22.54,22.86 IC6.4 21.17,21.06 v20.32,22.23 | v9.84,5.71 9.84,5.08 | 9.84,5.08 JP4.1
VNEG  (via drill 0.7 pad 1.42)
  Top 0.61: v102.23,3.17 v102.23,8.57 | v97.79,30.16 96.2,28.57 93.66,28.57 90.49,24.13 90.49,22.86 82.55,15.56 v82.55,3.81 | v31.43,10.16 v31.43,4.45
  Bottom 0.61: R9.3 90.81,14.29 90.81,10.16 92.08,8.89 101.6,8.89 101.92,9.21 | 101.92,9.21 102.55,9.84 JP8.3 | JP4.3 31.43,3.17 | 31.43,3.17 82.55,3.17 | 82.55,3.17 v102.23,3.17 | v102.23,8.57 101.92,9.21 | IC5.11 98.74,27.3 97.79,28.26 v97.79,30.16 | v82.55,3.81 82.55,3.17 | R17.1 D1.A 32.38,14.61 31.43,13.65 v31.43,10.16 | v31.43,4.45 31.43,3.17
W0
  Bottom 0.406: IC2.12 42.86,22.86 45.4,25.4 JP7.1
W1
  Bottom 0.406: IC2.13 44.13,22.23 46.04,24.13 54.93,24.13 JP7.2
W2
  Bottom 0.406: JP7.3 46.67,22.86 45.4,21.59 IC2.14
W3
  Bottom 0.406: IC2.15 46.67,20.95 47.31,21.59 54.93,21.59 JP7.4
W4
  Bottom 0.406: JP7.5 52.39,20.32
  Bottom 0.61: 52.39,20.32 51.75,19.68 51.75,14.92 49.85,13.02 48.04,13.02 IC2.1
W5
  Bottom 0.406: IC2.2 46.67,12.06 47.31,11.43 54.93,11.43 JP7.12
W6
  Bottom 0.406: JP7.13 45.72,10.16 44.13,11.75 IC2.4
W7
  Bottom 0.406: JP7.14 54.93,8.89 44.77,8.89 42.86,10.79 IC2.5
W_EN
  Bottom 0.406: 41.59,10.79 41.59,10.16 43.81,7.62 JP7.15
  Bottom 0.61: IC2.6 41.59,10.79 37.15,10.79 35.56,12.38 35.56,17.14 37.78,19.37 37.78,25.4 42.86,30.48 47.62,30.48 M1.J7.8
WMUX_A
  Bottom 0.406: M1.J7.5 51.44,26.67 44.77,26.67 41.59,23.5 IC2.11
WMUX_B
  Bottom 0.406: IC2.10 40.32,24.13 44.13,27.94 50.16,27.94 M1.J7.6
WMUX_C
  Bottom 0.406: IC2.9 39.05,24.77 43.5,29.21 48.9,29.21 M1.J7.7

### Text on the board
Bottom: Monophono board V3
Document: B001 | GAZ'21 | MONOPHONO V3 | WILL THIS BOARD WORKS FOR MORE THAN 30"?